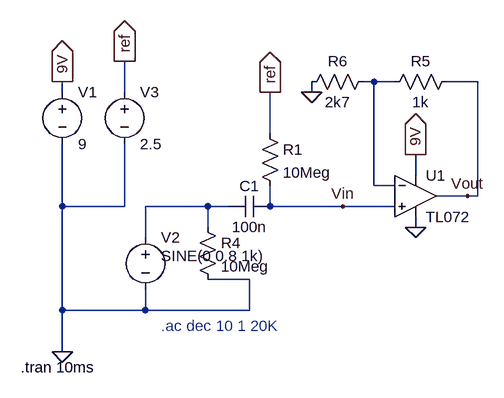
[diagram p0: schematic Simu_input_buffer.asc]
Simu_input_buffer.asc, the LTspice schematic file:
Version 4
SHEET 1 880 680
WIRE 176 -160 160 -160
WIRE 208 -160 176 -160
WIRE 336 -160 288 -160
WIRE -304 -144 -304 -160
WIRE -208 -144 -208 -192
WIRE 80 -144 80 -160
WIRE 16 -80 16 -144
WIRE 240 -16 240 -48
WIRE 176 0 176 -160
WIRE 208 0 176 0
WIRE 320 16 272 16
WIRE 336 16 336 -160
WIRE 336 16 320 16
WIRE -304 32 -304 -64
WIRE -208 32 -208 -64
WIRE -208 32 -304 32
WIRE -80 32 -176 32
WIRE -48 32 -80 32
WIRE 16 32 16 0
WIRE 128 32 16 32
WIRE 208 32 128 32
WIRE -80 64 -80 32
WIRE 240 64 240 48
WIRE -176 80 -176 32
WIRE -16 144 -80 144
WIRE -304 192 -304 32
WIRE -176 192 -176 160
WIRE -176 192 -304 192
WIRE -16 192 -16 144
WIRE -16 192 -176 192
WIRE -304 256 -304 192
FLAG 240 64 0
FLAG -304 256 0
FLAG -304 -160 9V
IOPIN -304 -160 Out
FLAG 240 -48 9V
IOPIN 240 -48 Out
FLAG -208 -192 ref
IOPIN -208 -192 Out
FLAG 16 -144 ref
IOPIN 16 -144 Out
FLAG 80 -144 0
FLAG 320 16 Vout
FLAG 128 32 Vin
DATAFLAG 336 -80 ""
SYMBOL TL072 240 -48 R0
SYMATTR InstName U1
SYMBOL voltage -304 -160 R0
WINDOW 123 0 0 Left 0
WINDOW 39 0 0 Left 0
SYMATTR InstName V1
SYMATTR Value 9
SYMBOL voltage -176 64 R0
WINDOW 3 24 44 Left 2
WINDOW 123 24 124 Left 2
WINDOW 39 0 0 Left 0
SYMATTR Value SINE(0 0.8 1k)
SYMATTR InstName V2
SYMBOL voltage -208 -160 R0
WINDOW 123 0 0 Left 0
WINDOW 39 0 0 Left 0
SYMATTR InstName V3
SYMATTR Value 2.5
SYMBOL res 0 -96 R0
SYMATTR InstName R1
SYMATTR Value 10Meg
SYMBOL cap 16 16 R90
WINDOW 0 0 32 VBottom 2
WINDOW 3 32 32 VTop 2
SYMATTR InstName C1
SYMATTR Value 100n
SYMBOL res -96 48 R0
SYMATTR InstName R4
SYMATTR Value 10Meg
SYMBOL res 304 -176 R90
WINDOW 0 0 56 VBottom 2
WINDOW 3 32 56 VTop 2
SYMATTR InstName R5
SYMATTR Value 1k
SYMBOL res 176 -176 R90
WINDOW 0 0 56 VBottom 2
WINDOW 3 32 56 VTop 2
SYMATTR InstName R6
SYMATTR Value 2k7
TEXT -368 280 Left 2 !.tran 10ms
TEXT -152 216 Left 2 ;.ac dec 10 1 20K

The netlist it stands for:
* Simu_input_buffer.asc
* U1: TL072 (symbol TL072 not available, pins judged from their places): In+=Vin In-=N001 V+=9V V-=0 OUT=Vout
V1 9V 0 9
V2 N002 0 SINE(0 0.8 1k)
V3 ref 0 2.5
R1 ref Vin 10Meg
C1 Vin N002 100n
R4 N002 0 10Meg
R5 Vout N001 1k
R6 N001 0 2k7
.tran 10ms
* .ac dec 10 1 20K
.backanno
.end